# Altium schematic sheet Motor-Connector.SchDoc
size 420 x 297 mm; SheetNumber: 3; SheetTotal: 7
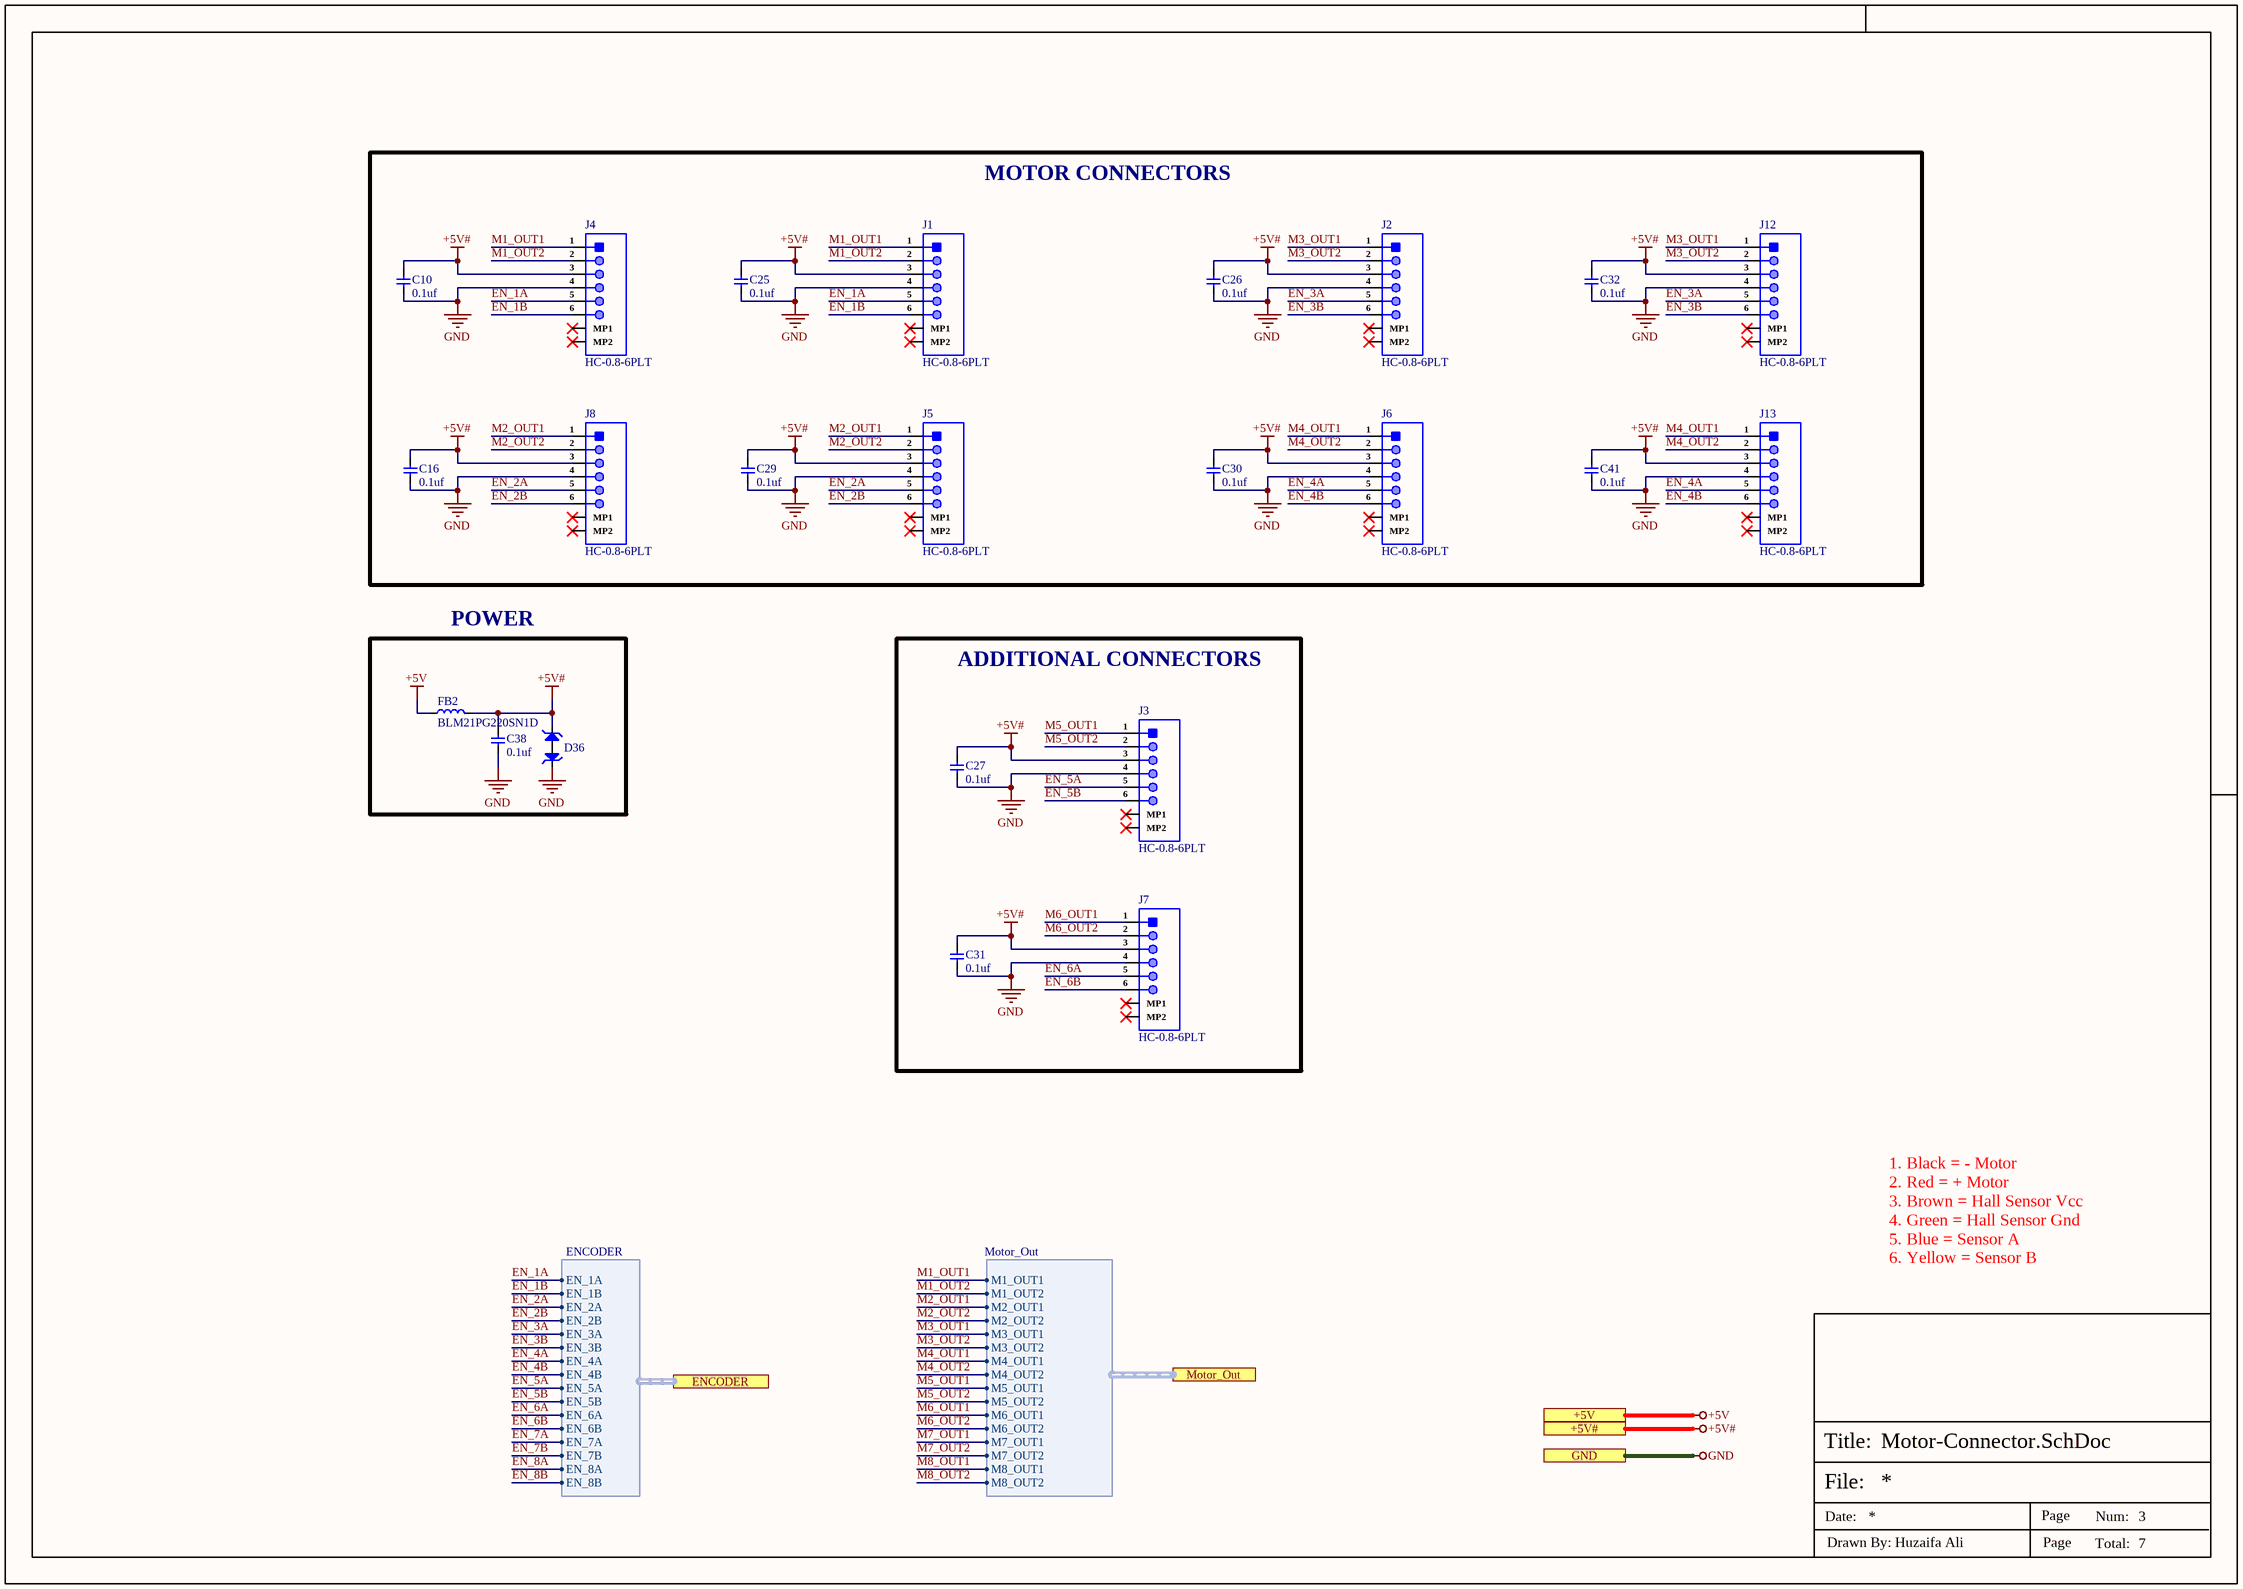
[diagram p0: Motor-Connector.SchDoc]

## Parts
C10  0.1uf  [Cap-0402]
C16  0.1uf  [Cap-0402]
C25  0.1uf  [Cap-0402]
C26  0.1uf  [Cap-0402]
C27  0.1uf  [Cap-0402]
C29  0.1uf  [Cap-0402]
C30  0.1uf  [Cap-0402]
C31  0.1uf  [Cap-0402]
C32  0.1uf  [Cap-0402]
C38  0.1uf  [Cap-0402]
C41  0.1uf  [Cap-0402]
D36  PESD5V0H1BSFYL  [DSN0603-2]  (value not drawn)
FB2  BLM21PG220SN1D  [Ind-0805]
J1  HC-0.8-6PLT  [HC-0.8-6PLT]
J2  HC-0.8-6PLT  [HC-0.8-6PLT]
J3  HC-0.8-6PLT  [HC-0.8-6PLT]
J4  HC-0.8-6PLT  [HC-0.8-6PLT]
J5  HC-0.8-6PLT  [HC-0.8-6PLT]
J6  HC-0.8-6PLT  [HC-0.8-6PLT]
J7  HC-0.8-6PLT  [HC-0.8-6PLT]
J8  HC-0.8-6PLT  [HC-0.8-6PLT]
J12  HC-0.8-6PLT  [HC-0.8-6PLT]
J13  HC-0.8-6PLT  [HC-0.8-6PLT]

## Blocks framed on the sheet
MOTOR CONNECTORS: C10 C16 C25 C26 C29 C30 C32 C41 J1 J2 J4-J6 J8 J12 J13
POWER: C38 D36 FB2
ADDITIONAL CONNECTORS: C27 C31 J3 J7

## Ports
+5V (see Top-Sheet[2B], Connector-Sheet[5D]), +5V# (see Top-Sheet[2B], CAN-Sheet[5D]), ENCODER (harness ENCODER, see Top-Sheet[2B], Controller-Sheet[1D]), GND (see Top-Sheet[2B], CAN-Sheet[5D], Connector-Sheet[5D], Controller-Sheet[5D], Current-Sense-Sheet[5D], Motor-Driver-Sheet[5D]), Motor_Out (harness Motor_Out, see Top-Sheet[2B], Motor-Driver-Sheet[4D])

## Harnesses
Motor_Out: M1_OUT1, M1_OUT2, M2_OUT1, M2_OUT2, M3_OUT1, M3_OUT2, M4_OUT1, M4_OUT2, M5_OUT1, M5_OUT2, M6_OUT1, M6_OUT2, M7_OUT1, M7_OUT2, M8_OUT1, M8_OUT2
ENCODER: EN_2B, EN_3A, EN_3B, EN_4A, EN_4B, EN_5A, EN_5B, EN_6A, EN_6B, EN_7A, EN_7B, EN_2A, EN_1B, EN_1A, EN_8A, EN_8B

## Nets
+5V: FB2.1 ; port +5V
+5V#: C10.2 C16.2 C25.2 C26.2 C27.2 C29.2 C30.2 C31.2 C32.2 C38.2 C41.2 D36.1 FB2.2 J1.3 J2.3 J3.3 J4.3 J5.3 J6.3 J7.3 J8.3 J12.3 J13.3 ; port +5V#
GND: C10.1 C16.1 C25.1 C26.1 C27.1 C29.1 C30.1 C31.1 C32.1 C38.1 C41.1 D36.2 J1.4 J2.4 J3.4 J4.4 J5.4 J6.4 J7.4 J8.4 J12.4 J13.4 ; port GND
EN_1A: J1.5 J4.5 ; port ENCODER.EN_1A
EN_1B: J1.6 J4.6 ; port ENCODER.EN_1B
EN_2A: J5.5 J8.5 ; port ENCODER.EN_2A
EN_2B: J5.6 J8.6 ; port ENCODER.EN_2B
EN_3A: J2.5 J12.5 ; port ENCODER.EN_3A
EN_3B: J2.6 J12.6 ; port ENCODER.EN_3B
EN_4A: J6.5 J13.5 ; port ENCODER.EN_4A
EN_4B: J6.6 J13.6 ; port ENCODER.EN_4B
EN_5A: J3.5 ; port ENCODER.EN_5A
EN_5B: J3.6 ; port ENCODER.EN_5B
EN_6A: J7.5 ; port ENCODER.EN_6A
EN_6B: J7.6 ; port ENCODER.EN_6B
EN_7A: port ENCODER.EN_7A
EN_7B: port ENCODER.EN_7B
EN_8A: port ENCODER.EN_8A
EN_8B: port ENCODER.EN_8B
M1_OUT1: J1.1 J4.1 ; port Motor_Out.M1_OUT1
M1_OUT2: J1.2 J4.2 ; port Motor_Out.M1_OUT2
M2_OUT1: J5.1 J8.1 ; port Motor_Out.M2_OUT1
M2_OUT2: J5.2 J8.2 ; port Motor_Out.M2_OUT2
M3_OUT1: J2.1 J12.1 ; port Motor_Out.M3_OUT1
M3_OUT2: J2.2 J12.2 ; port Motor_Out.M3_OUT2
M4_OUT1: J6.1 J13.1 ; port Motor_Out.M4_OUT1
M4_OUT2: J6.2 J13.2 ; port Motor_Out.M4_OUT2
M5_OUT1: J3.1 ; port Motor_Out.M5_OUT1
M5_OUT2: J3.2 ; port Motor_Out.M5_OUT2
M6_OUT1: J7.1 ; port Motor_Out.M6_OUT1
M6_OUT2: J7.2 ; port Motor_Out.M6_OUT2
M7_OUT1: port Motor_Out.M7_OUT1
M7_OUT2: port Motor_Out.M7_OUT2
M8_OUT1: port Motor_Out.M8_OUT1
M8_OUT2: port Motor_Out.M8_OUT2

Not connected (* = marked no-connect by the designer): J1 MP1* MP2*; J2 MP1* MP2*; J3 MP1* MP2*; J4 MP1* MP2*; J5 MP1* MP2*; J6 MP1* MP2*; J7 MP1* MP2*; J8 MP1* MP2*; J12 MP1* MP2*; J13 MP1* MP2*

## Notes on the sheet
- 1. Black = - Motor
  2. Red = + Motor
  3. Brown = Hall Sensor Vcc
  4. Green = Hall Sensor Gnd
  5. Blue = Sensor A
  6. Yellow = Sensor B
- File:
- Title:
- Date:
- Page
- Num:
- Total:
- Drawn By: Huzaifa Ali

## Library data of the parts
C10 C16 C25-C27 C29-C32 C38 C41 = GRM155R62A104KE14D: CAP CER 0.1UF 100V X5R 0402; Manufacturer: Murata; Capacitance: 100nF; Tolerance: 10%; Item Type: Capacitor; Supplier 1: Arrow Electronics; Manufacturer Part Number: GRM155R62A104KE14D; RoHS: Yes; Category: Ceramic Capacitors; Stock 1: 870000; Pricing 1: 10000=0.00500, 20000=0.00410, 30000=0.00390, 50000=0.00370, 100000=0.00300 (USD); Mount: Surface Mount; Case/Package: 0402; Case Code (Metric): 1005; Case Code (Imperial): 0402; Weight: 0.000212oz; Min Operating Temperature: -55°C; Max Operating Temperature: 85°C; Packaging: Tape and Reel; Voltage Rating: 100V; Dielectric: X5R; Termination: SMD/SMT; Voltage Rating (DC): 100V; Package Quantity: 10000; Series: GRM; Length: 0.039inch; Width: 0.02inch; Height: 0.5mm; Thickness: 0.022inch; Reach SVHC Compliant: Yes; Lead Free: Lead Free; RoHS Compliant: Yes; ComponentLink1URL: http://www.farnell.com/datasheets/2079151.pdf?src-supplier=Farnell; ComponentLink1Description: http://www.farnell.com/datasheets/2079151.pdf?src-supplier=Farnell; ComponentLink2URL: http://www.mouser.com/ds/2/281/c02e-2905.pdf?src-supplier=Mouser; ComponentLink2Description: http://www.mouser.com/ds/2/281/c02e-2905.pdf?src-supplier=Mouser; ComponentLink3URL: http://www.farnell.com/datasheets/2079151.pdf?src-supplier=Element14; ComponentLink3Description: http://www.farnell.com/datasheets/2079151.pdf?src-supplier=Element14; ComponentLink4URL: http://search.murata.co.jp/Ceramy/image/img/A01X/G101/ENG/GRM155R62A104KE14-01.pdf?src-supplier=Digi-Key; ComponentLink4Description: http://search.murata.co.jp/Ceramy/image/img/A01X/G101/ENG/GRM155R62A104KE14-01.pdf?src-supplier=Digi-Key; ComponentLink5URL: http://www.farnell.com/datasheets/2079151.pdf?src-supplier=Newark; ComponentLink5Description: http://www.farnell.com/datasheets/2079151.pdf?src-supplier=Newark; Supplier Part Number 1: GRM155R62A104KE14D; LCSC Part Number: C162178
D36 = PESD5V0H1BSFYL: TVS DIODE 5VWM 6.3VC DSN0603-2; Manufacturer: Nexperia; Supplier 1: Avnet; Manufacturer Part Number: PESD5V0H1BSFYL; RoHS: Yes; Category: ESD and Circuit Protection ICs; Stock 1: 9000; Pricing 1: 18000=0.06453, 36000=0.06278, 54000=0.06104, 90000=0.05930, 180000=0.05755, 900000=0.05581, 1800000=0.05406 (USD); RoHS Compliant: Yes; ComponentLink1URL: http://www.farnell.com/datasheets/1961312.pdf?src-supplier=Farnell; ComponentLink1Description: http://www.farnell.com/datasheets/1961312.pdf?src-supplier=Farnell; ComponentLink2URL: https://assets.nexperia.com/documents/data-sheet/PESD5V0H1BSF.pdf?src-supplier=Digi-Key; ComponentLink2Description: https://assets.nexperia.com/documents/data-sheet/PESD5V0H1BSF.pdf?src-supplier=Digi-Key; ComponentLink3URL: http://www.farnell.com/datasheets/1961312.pdf?src-supplier=Newark; ComponentLink3Description: http://www.farnell.com/datasheets/1961312.pdf?src-supplier=Newark; Supplier Part Number 1: PESD5V0H1BSFYL; LCSC Part Number: C477989; Item Type: Diode
FB2 = BLM21PG220SN1D: FERRITE BEAD 22 OHM 0805 1LN; Manufacturer: Murata; Supplier: Rs; Supplier Part Number: 7241539P; Manufacturer Part Number: BLM21PG220SN1D; RoHS: Yes; Category: Ferrite Beads and Chips; Stock: 10325; Pricing: 500=0.043, 1000=0.038, 2500=0.033, 5000=0.03 (GBP); ComponentLink1URL: https://datasheet.ciiva.com/14122/anblm21p-data-e-14122211.pdf?src-supplier=Distrelec; ComponentLink1Description: https://datasheet.ciiva.com/14122/anblm21p-data-e-14122211.pdf?src-supplier=Distrelec; ComponentLink2URL: https://datasheet.ciiva.com/11799/0900766b81275e31-11799177.pdf?src-supplier=Rs; ComponentLink2Description: https://datasheet.ciiva.com/11799/0900766b81275e31-11799177.pdf?src-supplier=Rs; ComponentLink3URL: https://datasheet.ciiva.com/29700/1845312-29700540.pdf?src-supplier=Jameco; ComponentLink3Description: https://datasheet.ciiva.com/29700/1845312-29700540.pdf?src-supplier=Jameco; ComponentLink4URL: https://datasheet.ciiva.com/16291/l0110s0100blm21p-16291622.pdf?src-supplier=Future+Electronics; ComponentLink4Description: https://datasheet.ciiva.com/16291/l0110s0100blm21p-16291622.pdf?src-supplier=Future+Electronics; ComponentLink5URL: https://datasheet.ciiva.com/8021/5160-8021589.pdf?src-supplier=Element14; ComponentLink5Description: https://datasheet.ciiva.com/8021/5160-8021589.pdf?src-supplier=Element14; ComponentLink6URL: https://datasheet.ciiva.com/8021/5160-8021591.pdf?src-supplier=Element14; ComponentLink6Description: https://datasheet.ciiva.com/8021/5160-8021591.pdf?src-supplier=Element14; ComponentLink7URL: https://datasheet.ciiva.com/6211/l0110s0100blm21p-6211741.pdf?src-supplier=Digi-Key; ComponentLink7Description: https://datasheet.ciiva.com/6211/l0110s0100blm21p-6211741.pdf?src-supplier=Digi-Key; ComponentLink8URL: https://datasheet.ciiva.com/3081/l0110s0100blm21p-3081653.pdf?src-supplier=Avnet; ComponentLink8Description: https://datasheet.ciiva.com/3081/l0110s0100blm21p-3081653.pdf?src-supplier=Avnet; ComponentLink9URL: https://datasheet.ciiva.com/41449/001171738-da-01-en-chip-drossel0805-22r0-6000ma-2-0x1-25mm-41449366.pdf?src-supplier=Conrad; ComponentLink9Description: https://datasheet.ciiva.com/41449/001171738-da-01-en-chip-drossel0805-22r0-6000ma-2-0x1-25mm-41449366.pdf?src-supplier=Conrad; LCSC Part Number: C88993; Item Type: Ferrite Bead
J1-J8 J12 J13 = HC-0.8-6PLT: 1x6P 6P 1 Tin 0.8mm 6 -25℃~+85℃ Phosphor Bronze 500mA Standing paste SMD,P=0.8mm Wire To Board Connector ROHS; Manufacturer: HCTL; Manufacturer Part Number: HC-0.8-6PLT; Package: SMD,P=0.8mm; LCSC Part Number: C2845356; Item Type: Connector; ComponentLink1Description: LCSC; ComponentLink1URL: https://www.lcsc.com/product-detail/Wire-To-Board-Connector_HCTL-HC-0-8-6PLT_C2845356.html